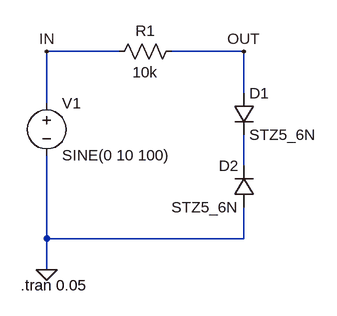
[diagram p0: schematic Zener_clipper.asc]
Zener_clipper.asc, the LTspice schematic file:
Version 4.1
SHEET 1 880 680
WIRE 176 32 64 32
WIRE 368 32 256 32
WIRE 368 96 368 32
WIRE 64 112 64 32
WIRE 368 208 368 160
WIRE 64 320 64 192
WIRE 368 320 368 272
WIRE 368 320 64 320
WIRE 64 368 64 320
FLAG 64 368 0
FLAG 64 32 IN
FLAG 368 32 OUT
SYMBOL voltage 64 96 R0
WINDOW 123 0 0 Left 0
WINDOW 39 0 0 Left 0
SYMATTR InstName V1
SYMATTR Value SINE(0 10 100)
SYMBOL res 272 16 R90
WINDOW 0 0 56 VBottom 2
WINDOW 3 32 56 VTop 2
SYMATTR InstName R1
SYMATTR Value 10k
SYMBOL diode 352 96 R0
SYMATTR InstName D1
SYMATTR Value STZ5_6N
SYMBOL diode 384 272 R180
WINDOW 0 24 64 Left 2
WINDOW 3 24 0 Left 2
SYMATTR InstName D2
SYMATTR Value STZ5_6N
TEXT 24 392 Left 2 !.tran 0.05

The netlist it stands for:
* Zener_clipper.asc
V1 IN 0 SINE(0 10 100)
R1 OUT IN 10k
D1 OUT N001 STZ5_6N
D2 0 N001 STZ5_6N
.model D D
.lib standard.dio
.tran 0.05
.backanno
.end

* Results of the author's LTspice run, read from the files saved beside the schematic
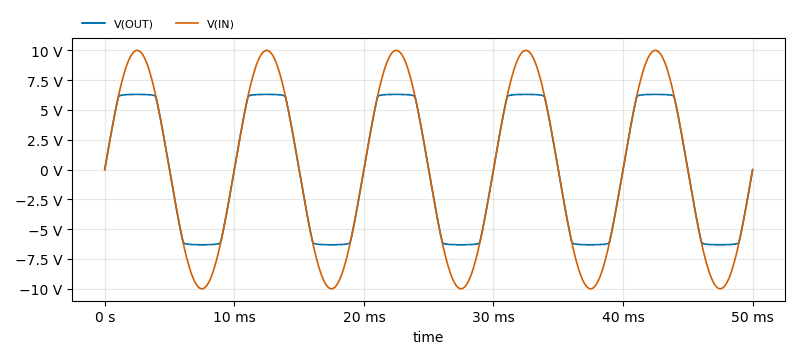
[diagram p1: Transient Analysis of Zener_clipper.asc, plotted from the saved traces]
* Transient Analysis, 1 run:
*   V(OUT): min -6.306 V, max 6.306 V, average -112.6 µV, rms 5.328 V, last -408.9 µV
*   V(IN): min -10 V, max 9.999 V, average -113.2 µV, rms 7.07 V, last 0 V